# EasyEDA Pro project SoPi.epro, board PCB1
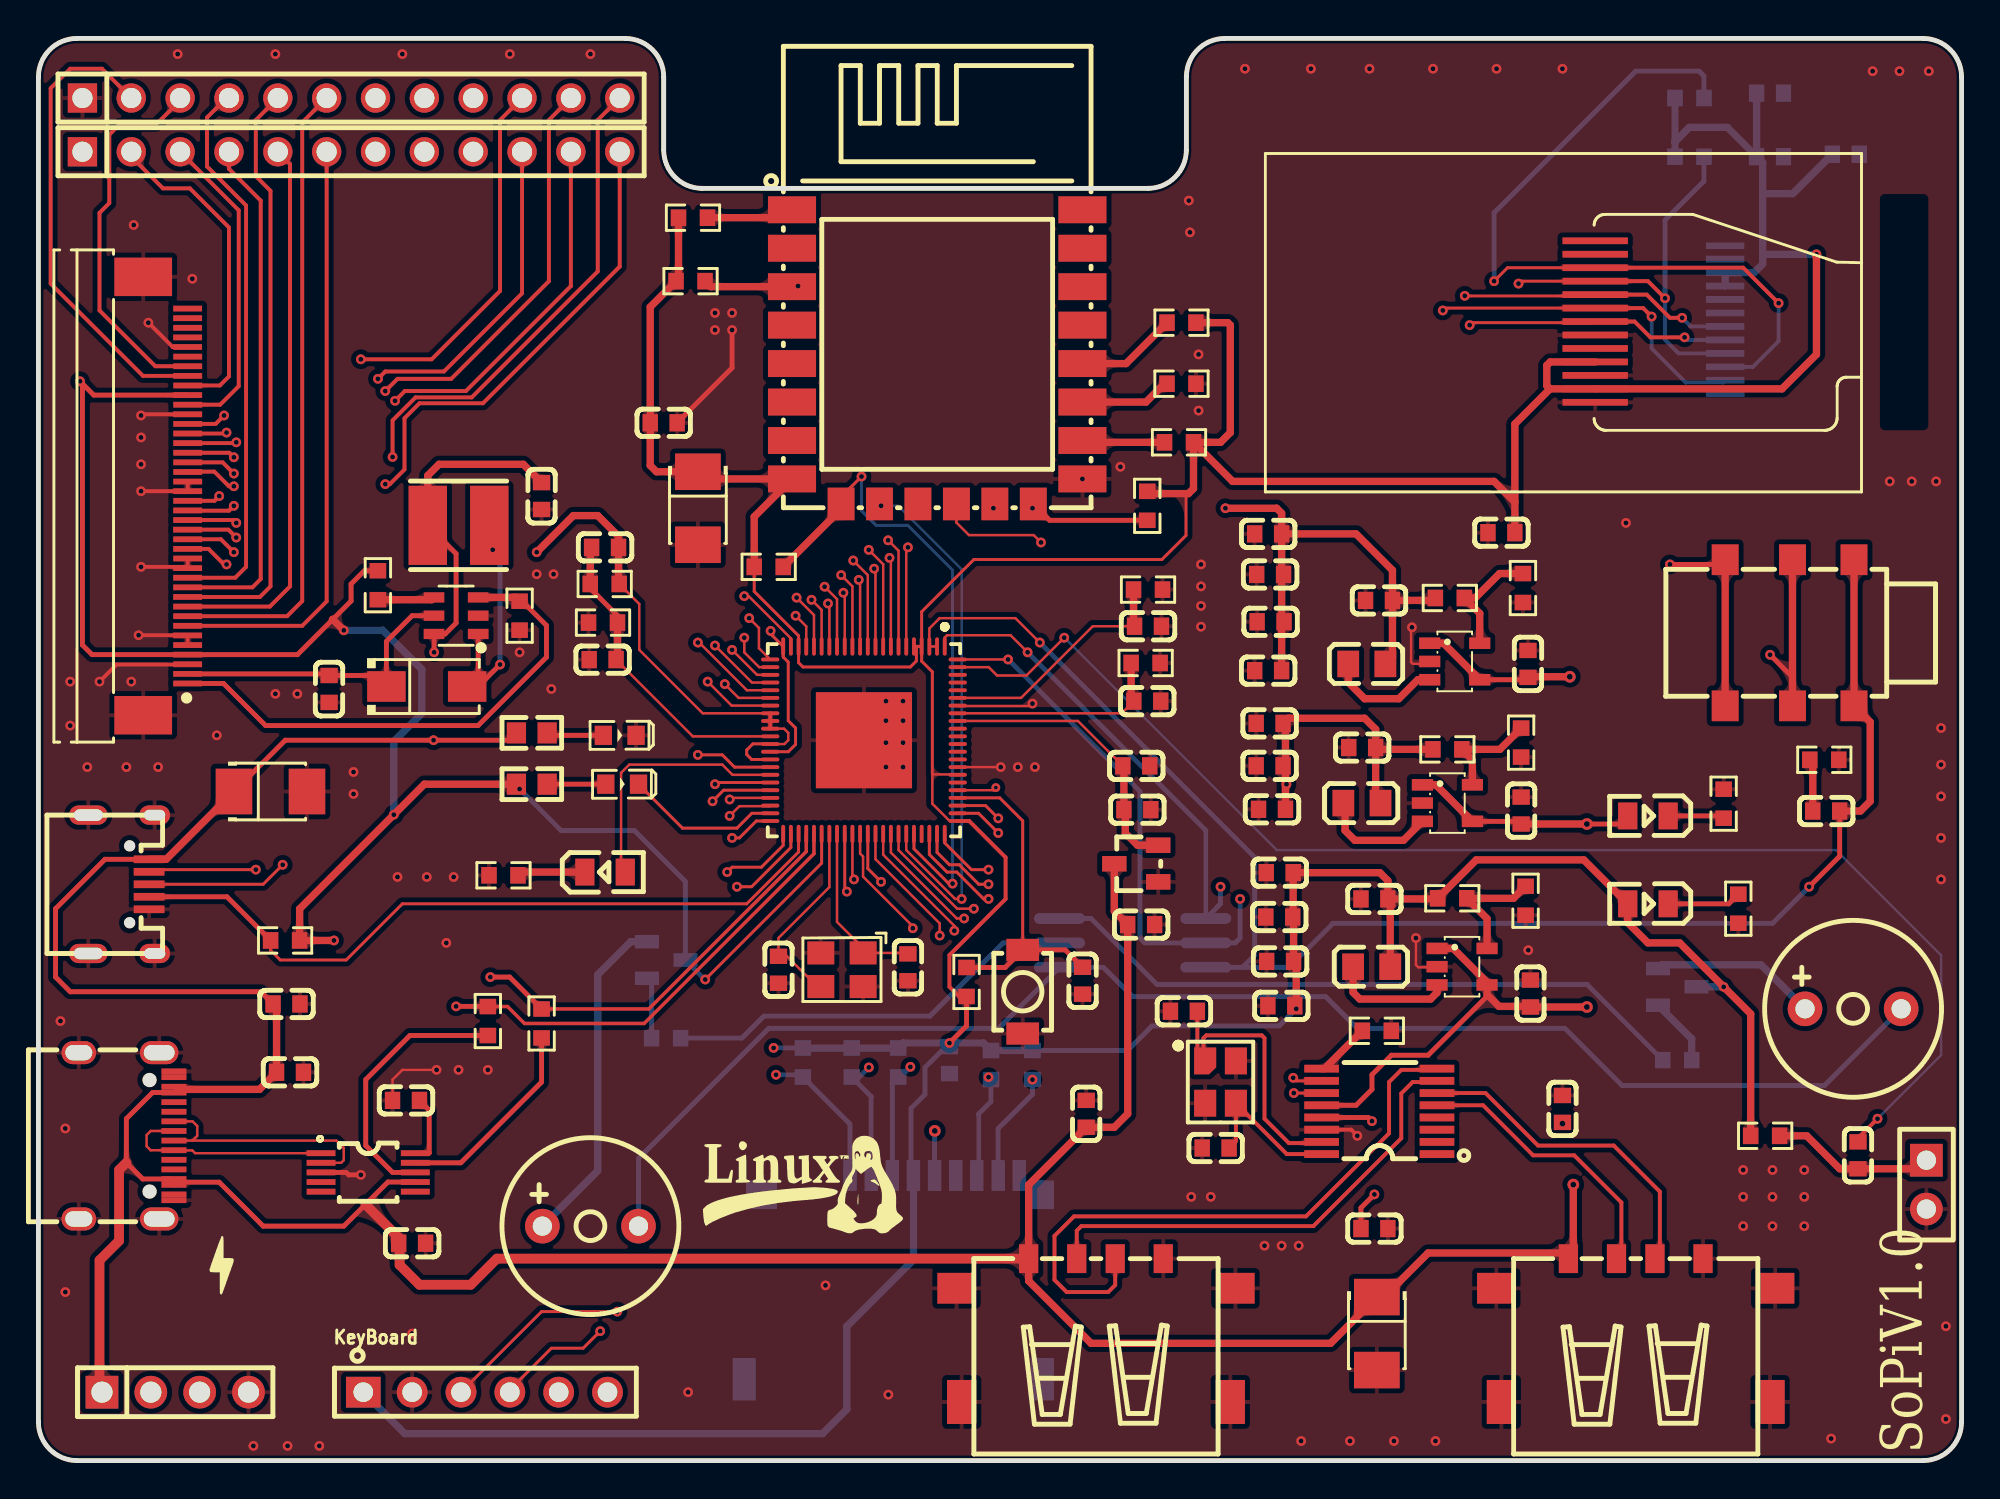
[diagram p2: board, top side]
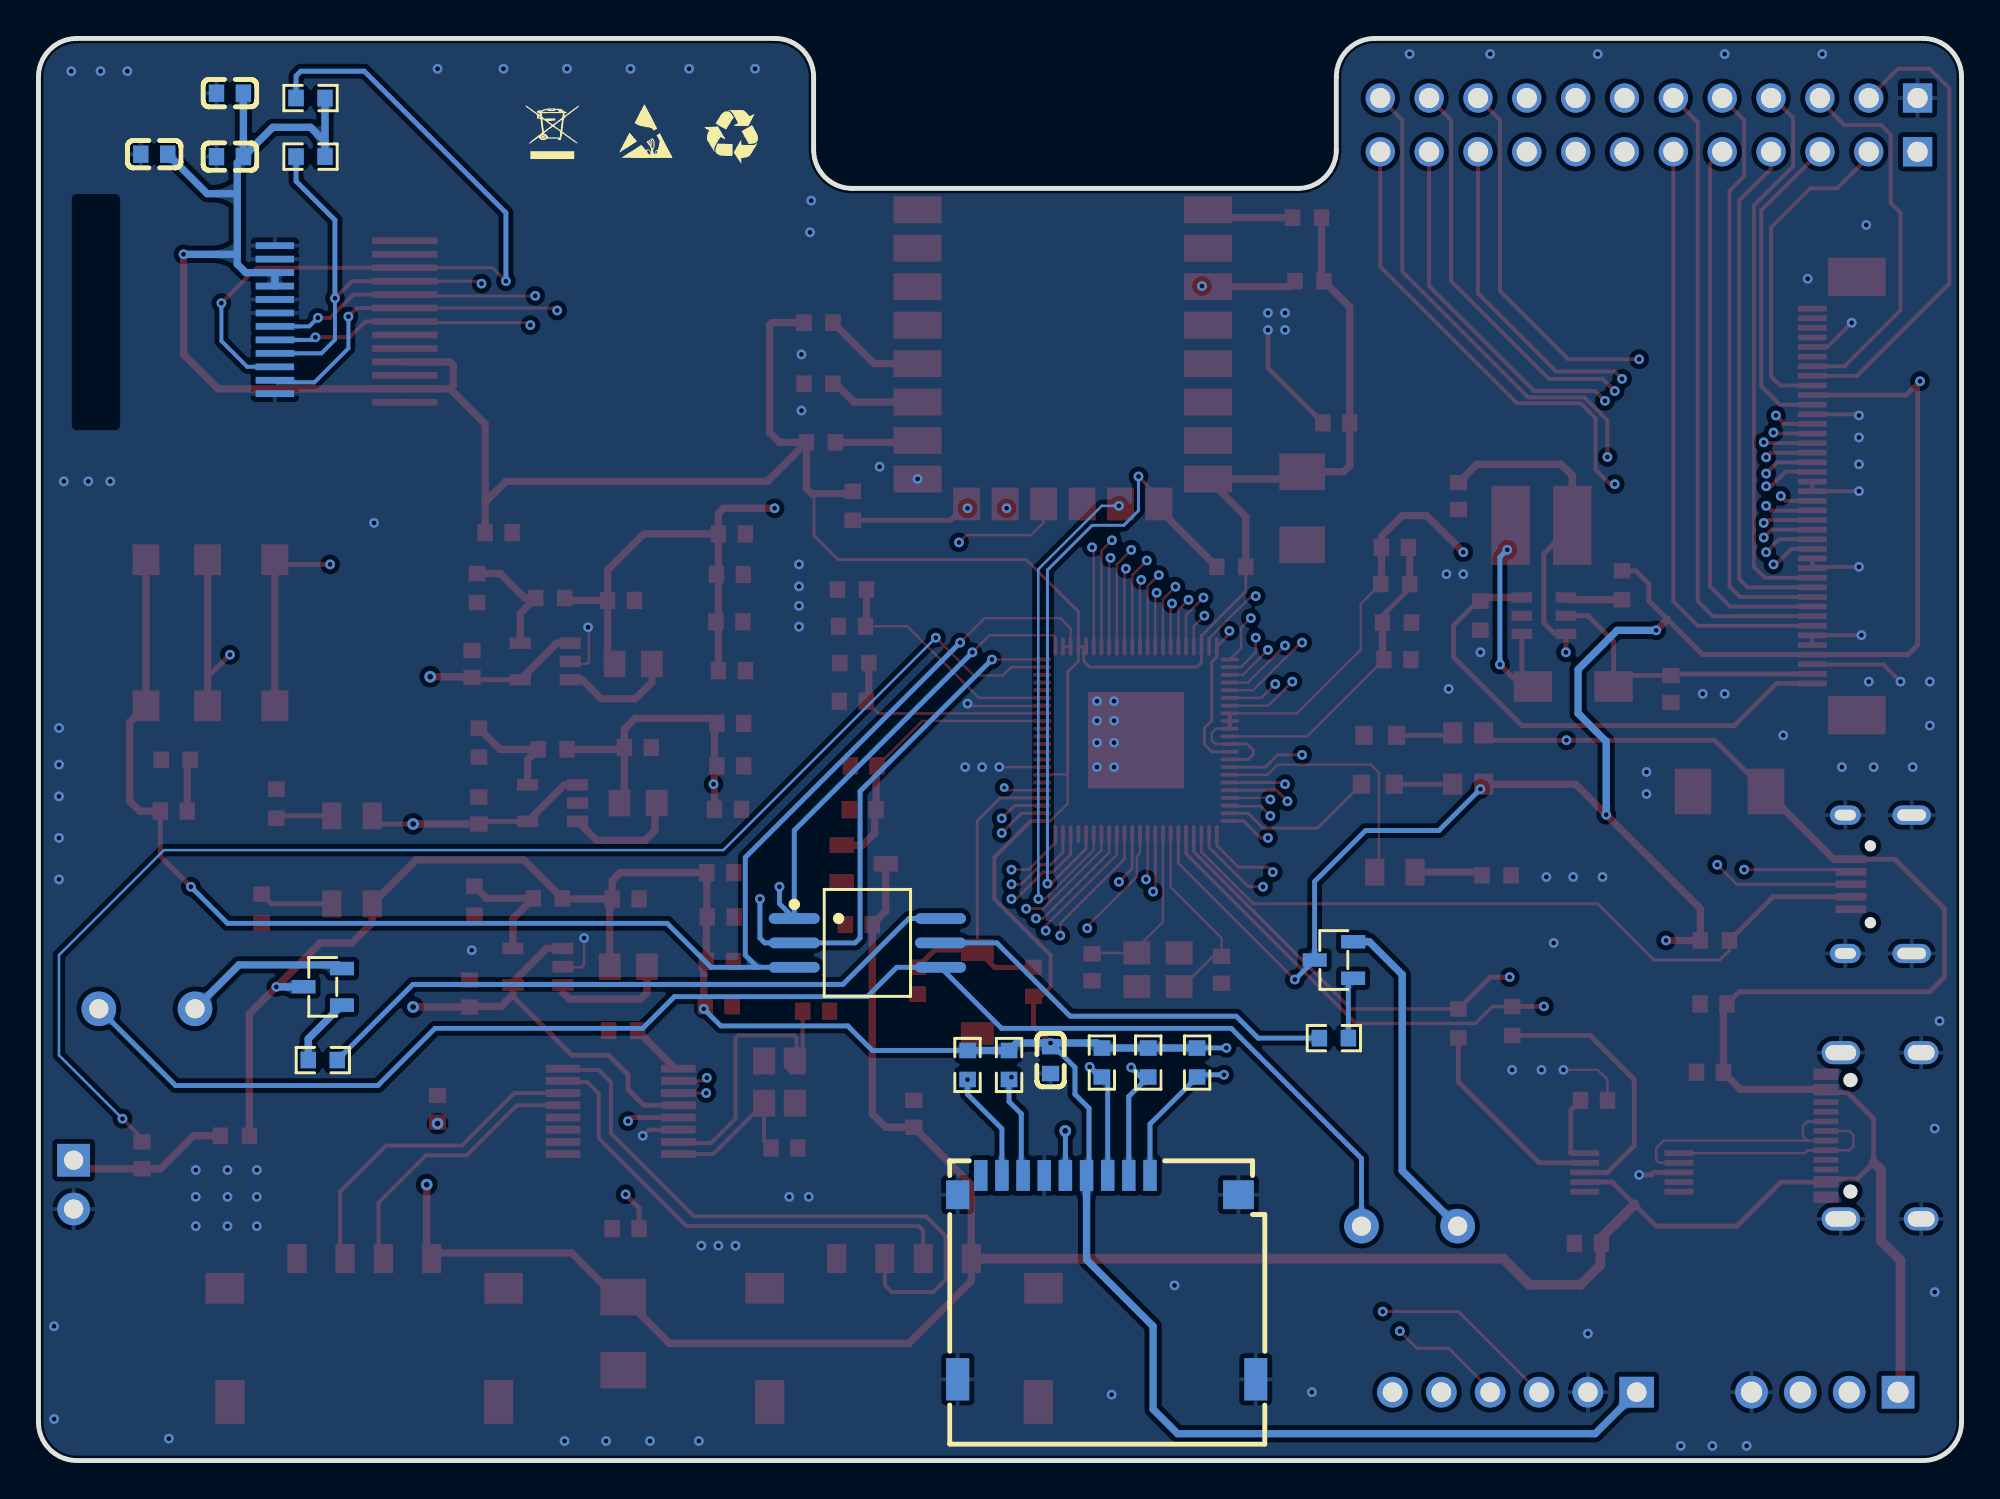
[diagram p3: board, bottom side, seen from below]

Outline 100 x 73.97 mm; copper layers: Top Layer, Inner1, Inner2, Bottom Layer. Coordinates in mm from the lower left corner of the outline.
Outline path: 0,71.97 arc(0.59,73.38) 2,73.97 30.51,73.97 arc(31.93,73.38) 32.51,71.97 32.51,68.17 arc(33.1,66.75) 34.51,66.17 57.69,66.17 arc(59.11,66.75) 59.69,68.17 59.69,71.97 arc(60.28,73.38) 61.69,73.97 98,73.97 arc(99.41,73.38) 100,71.97 100,2 arc(99.41,0.59) 98,0 2,0 arc(0.59,0.59) 0,2 0,71.97
Stack: Top Layer 0.035mm 外层铜厚1oz / Dielectric1 0.2104mm 7628 RC49% 8.6mil / Inner1 0.0152mm 内层铜厚 / Dielectric2 1.065mm 1.1mm H/HOZ Copper / Inner2 0.0152mm 内层铜厚 / Dielectric3 0.2104mm 7628 RC49% 8.6mil / Bottom Layer 0.035mm 外层铜厚1oz

## Design rules (mm)
template: 自定义配置
spacing copperThickness1oz (default): track to track 0.102, other pairs 0.152 to 0.3
spacing copperThickness2oz: track to track 0.203, other pairs 0.152 to 0.3
track width copperThickness1oz (default): min 0.102, default 0.127, max 2.54
track width copperThickness2oz: min 0.127, default 0.381, max 2.54
differential pair differentialPair (default): width min 0.127, default 0.254, max 2.54; gap min 0.152, default 0.152
via viaSize (default): diameter min 0.457, default 0.508, max 10; hole min 0.203, default 0.254, max 6.299
net +2V5 uses copperThickness2oz
net +3V0 uses copperThickness2oz
net +3V3 uses copperThickness2oz
net +1V1 uses copperThickness2oz
net +5V uses copperThickness2oz

## Placement (name value [footprint] x y rotation side)
2G1  10K  [R0603]  59.44 56.01 180 top
15V1  10K  [R0603]  59.31 52.96 180 top
BUZZER1  2.7kHz  [BUZ-TH_BD9.0-P5.00-D0.6-FD]  94.36 23.5 0 top
BUZZER2  2.7kHz  [BUZ-TH_BD9.0-P5.00-D0.6-FD]  28.7 12.19 0 top
C1  100nF  [C0603]  29.46 47.5 0 top
C2  100nF  [C0603]  29.34 41.66 0 top
C3  22pf  [C0603]  45.21 25.65 90 top
C4  10uF  [C0603]  54.29 24.96 270 top
C5  22pf  [C0603]  38.48 25.53 90 top
C6  10uF  [C0603]  57.14 33.85 180 top
C7  100nF  [C0603]  57.09 36.13 180 top
C8  100nF  [C0603]  64.52 28.27 180 top
C9  100nF  [C0603]  64.54 30.58 0 top
C10  100nF  [C0603]  64.57 25.96 0 top
C11  100nF  [C0603]  64.07 43.62 0 top
C12  100nF  [C0603]  64.63 23.65 180 top
C13  10uF  [C0603]  69.47 29.21 0 top
C14  100nF  [C0603]  63.94 41.08 0 top
C15  1uF  [C0603]  64.05 46.09 0 top
C16  10uF  [C0603]  63.94 48.2 0 top
C17  100nF  [C0603]  64.14 33.87 0 top
C18  100nF  [C0603]  64.02 36.13 0 top
C19  100nF  [C0603]  64.02 38.34 0 top
C20  10uF  [C0603]  57.7 43.39 0 top
C21  10uF  [C0603]  57.66 39.5 0 top
C22  100nF  [C0603]  13.08 20.19 0 top
C23  10uF  [C0603]  12.9 23.75 0 top
C24  1uF  [CAP-SMD_L3.5-W2.8-R-RD]  69.6 6.6 90 top
C25  4.7uF  [C0603]  57.34 27.88 180 top
C26  10uF  [C0603]  77.58 24.29 90 top
C27  10uF  [C0603]  69.71 44.74 0 top
C28  10uF  [C0603]  68.83 37.08 0 top
C29  10uF  [C0603]  77.46 41.43 90 top
C30  10uF  [C0603]  77.1 33.81 90 top
C31  10uF  [C0603]  26.16 50.16 90 top
C32  1uF  [C0603]  15.11 40.13 90 top
C33  100nF  [CAP-SMD_L3.5-W2.8-R-RD]  34.29 49.53 90 top
C34  10uF  [C0603]  32.51 53.97 0 top
C35  104  [C0603]  92.96 33.78 180 top
C44  15pF  [C0603]  59.56 23.37 0 top
C45  15pF  [C0603]  61.21 16.26 0 top
C46  10uF  [C0603]  79.25 18.29 270 top
C47  100nF  [C0603]  54.48 18.03 270 top
C48  10uF  [C0603]  69.47 12.06 0 top
C55  0.1uF  [C0603]  90.04 67.82 180 bottom
C56  0.1uF  [C0603]  90.04 71.12 180 bottom
C57  0.1uF  [C0603]  93.98 67.94 180 bottom
C58  100nF  [C0603]  19.11 18.73 180 top
C60  1uF  [CAP-SMD_L3.5-W2.8-R-RD]  12.06 34.8 180 top
C61  4.7uF  [C0603]  76.07 48.26 180 top
C62  100nF  [C0603]  19.43 11.3 180 top
C63  100nF  [C0603]  47.37 20.83 270 bottom
C64  1uF  [C0603]  94.62 15.88 270 top
CN1  CK3.5-20-1  [AUDIO-SMD_CK3.5-20-1]  91.06 43.05 180 top
D1  -  [SMA_L4.3-W2.5-LS5.0-RD]  20.19 40.26 0 top
F1C200S1  F1C200S-88  [F1C100S/F1C200S]  42.93 37.47 270 top
H1  -  [HDR-TH_12P-P2.54-V-M]  16.26 70.87 0 top
H2  -  [HDR-TH_12P-P2.54-V-M]  16.26 68.07 0 top
KeyBoard  -  [HDR-TH_6P-P2.54-V-F]  23.24 3.56 0 top
L1  2.2uH  [L0805]  69.33 25.69 0 top
L2  2.2uH  [L0805]  69.07 41.43 0 top
L3  2.2uH  [L0805]  68.82 34.2 0 top
L4  22uH  [IND-SMD_L4.5-W4.0_SM4532]  21.84 48.64 0 top
LED1  0603  [LED0603_RED]  30.35 35.18 0 top
LED96  KT-0805G  [LED0805-R-RD]  29.46 30.61 0 top
LED97  KT-0805G  [LED0805-R-RD]  83.69 33.53 180 top
LED98  KT-0805G  [LED0805-R-RD]  83.69 28.96 180 top
MIC  -  [HDR-TH_2P-P2.54-V-F]  98.17 14.35 270 top
P1  AFC07-S40ECC-00  [CONN-SMD_AFC07-S40ECC-00]  6.6 50.16 90 top
POWER1  0603  [LED0603_RED]  30.23 37.72 0 top
POWER/TTL1  TYPE-C-31-M-12  [USB-C_SMD-TYPE-C-31-M-12]  4.57 16.89 270 top
Q3  S8550  [SOT-23-3_L2.9-W1.3-P1.90-LS2.4-BR]  85.22 24.64 180 bottom
Q4  S8550  [SOT-23-3_L2.9-W1.3-P1.90-LS2.4-BR]  32.64 26.03 180 bottom
R1  10K  [R0603]  12.83 27.05 180 top
R2  2K  [R0603#2]  25.65 37.85 0 top
R3  10K  [R0603]  44.7 20.7 270 bottom
R4  2K  [R0603#2]  25.65 35.18 0 top
R5  10K  [R0603]  39.75 20.7 270 bottom
R6  10K  [R0603]  85.85 67.82 180 bottom
R7  10K  [R0603]  51.69 20.57 90 bottom
R8  10K  [R0603]  48.26 24.89 90 top
R9  2.2K  [R0603]  29.45 45.59 0 top
R10  2.2K  [R0603]  29.36 43.58 0 top
R11  200K  [R0603]  57.7 45.3 0 top
R12  200K  [R0603]  57.57 41.48 0 top
R14  470  [R0603]  26.16 22.73 90 top
R15  470K  [R0603]  73.39 44.86 180 top
R16  150K  [R0603]  73.26 36.99 180 top
R18  470  [R0603]  23.37 22.86 90 top
R19  150K  [R0603]  77.1 37.34 90 top
R20  10K  [R0603]  34.04 64.64 0 top
R21  10K  [R0603]  33.91 61.34 0 top
R22  10K  [R0603]  59.44 59.18 0 top
R23  680K  [R0603]  73.52 29.24 180 top
R24  150K  [R0603]  77.33 29.12 90 top
R25  150K  [R0603]  77.19 45.38 90 top
R26  10kΩ  [R0603]  17.65 45.53 90 top
R27  12Ω  [R0603]  25.02 43.94 90 top
R28  10K  [R0603]  37.97 46.48 0 top
R29  10K  [R0603]  57.66 49.66 270 top
R30  22R  [R0603]  92.86 36.45 0 top
R73  1kΩ  [R0603]  85.22 20.83 180 bottom
R97  330Ω  [R0603]  24.18 30.44 0 top
R98  1kΩ  [R0603]  32.64 21.97 0 bottom
R99  2.2K  [R0603]  69.6 22.35 180 top
R101  330Ω  [R0603]  87.63 34.16 270 top
R102  330Ω  [R0603]  88.39 28.7 90 top
R103  10K  [R0603]  42.29 20.7 270 bottom
R104  10K  [R0603]  49.53 20.57 270 bottom
R105  10K  [R0603]  85.85 70.87 180 bottom
R109  1kΩ  [R0603]  89.79 16.89 0 top
RESET  ST-1185S  [SW-SMD_ST-1185S]  51.18 24.38 270 top
SD1  SD  [TF-SMD_TF-115K]  44.45 9.53 180 bottom
SW162  DSHP03TS-S  [SW-SMD_DSHP03TS-S]  56.9 26.92 270 bottom
U1  XC6206-3.0V  [SOT-23]  57.09 31.05 90 top
U2  1.14IPS-TFT  [1.14IPS]  79.12 59.31 0 top
U3  ESP-12F  [WIFIM-SMD_ESP-12F-ESP8266MOD]  46.74 57.4 270 top
U4  CH340E  [MSOP-10_L3.0-W3.0-P0.50-LS5.0-BL]  17.14 14.99 270 top
U6  SY8088AAC  [SOT-23-5_L3.0-W1.7-P0.95-LS2.8-BR]  73.65 41.56 180 top
U7  SY8088AAC  [SOT-23-5_L3.0-W1.7-P0.95-LS2.8-BR]  74.03 25.69 180 top
U8  FE8.1  [SSOP-16_L4.9-W3.9-P0.64-LS6.0-BL]  69.72 18.16 90 top
U9  SY8088AAC  [SOT-23-5_L3.0-W1.7-P0.95-LS2.8-BR]  73.26 34.2 180 top
U10  RY3730  [SOT-23-6_L2.9-W1.6-P0.95-LS2.8-BL]  21.72 43.94 90 top
U56  -  [1.47ST7789]  105.79 46.61 180 bottom
USART0  PZ254V-11-04P  [HDR-TH_4P-P2.54-V-M]  7.11 3.56 0 top
USB2  -  [USB-A]  83.06 6.73 0 top
USB3  -  [USB-A]  54.99 6.73 0 top
USB6  U-F-M5DD-W-2  [MICRO-USB-SMD_MICRO-USB-A17]  4.32 29.97 180 top
X1  24MHz  [OSC-SMD_4P-L3.2-W2.5-BL]  41.78 25.53 180 top
X2  12MHz  [OSC-SMD_4P-L3.2-W2.5-BL#2]  61.47 19.69 270 top

## Footprints (pads in the part's own frame, mm; a bottom-side part is the same pattern mirrored in y, then rotated)
1.14IPS
  rect 3.4x0.35 smd: 1(1.828,4.132) 2(1.828,3.432) 3(1.828,2.732) 4(1.828,2.032) 5(1.828,1.332) 6(1.828,0.632) 7(1.828,-0.068) 8(1.828,-0.768) 9(1.828,-1.468) 10(1.828,-2.168) 11(1.828,-2.868) 12(1.828,-3.568) 13(1.828,-4.268)
1.47ST7789
  rect 2x0.35 smd: 1(18.084,16.578) 2(18.084,15.878) 3(18.084,15.178) 4(18.084,14.478) 5(18.084,13.778) 6(18.084,13.078) 7(18.084,12.378) 8(18.084,11.678) 9(18.084,10.978) 10(18.084,10.278) 11(18.084,9.578) 12(18.084,8.878)
AUDIO-SMD_CK3.5-20-1
  rect 1.4x1.6 smd: 1(-3.35,3.8) 1(-3.35,-3.8) 2(-0.15,3.8) 2(-0.15,-3.8) 3(3.35,3.8) 3(3.35,-3.8)
BUZ-TH_BD9.0-P5.00-D0.6-FD
  round 1.8 hole 1: 1(-2.5,0) 2(2.5,0)
C0603
  rect 0.8x0.9 smd: 1(-0.7,0) 2(0.7,0)
CAP-SMD_L3.5-W2.8-R-RD
  rect 1.9x2.376 smd: 1(1.899,0) 2(-1.899,0)
CONN-SMD_AFC07-S40ECC-00
  rect 0.3x1.5 smd: 1(-9.75,-1.153) 2(-9.249,-1.153) 3(-8.749,-1.153) 4(-8.249,-1.153) 5(-7.75,-1.153) 6(-7.249,-1.153) 7(-6.749,-1.153) 8(-6.249,-1.153) 9(-5.749,-1.153) 10(-5.248,-1.153) 11(-4.748,-1.153) 12(-4.248,-1.153) 13(-3.748,-1.153) 14(-3.248,-1.153) 15(-2.748,-1.155) 16(-2.248,-1.154) 17(-1.748,-1.153) 18(-1.248,-1.153) 19(-0.748,-1.153) 20(-0.248,-1.157) 21(0.252,-1.157) 22(0.751,-1.157) 23(1.252,-1.157) 24(1.752,-1.157) 25(2.252,-1.157) 26(2.752,-1.157) 27(3.252,-1.157) 28(3.752,-1.157) 29(4.252,-1.157) 30(4.751,-1.157) 31(5.251,-1.157) 32(5.751,-1.157) 33(6.25,-1.157) 34(6.751,-1.157) 35(7.25,-1.157) 36(7.75,-1.153) 37(8.251,-1.153) 38(8.75,-1.153) 39(9.25,-1.153) 40(9.75,-1.153)
  rect 2x3 smd: 41(11.4,1.157) 42(-11.4,1.157)
F1C100S/F1C200S
  oval 0.95x0.2 smd: 1(-4.875,4.2) 2(-4.875,3.8) 3(-4.875,3.4) 4(-4.875,2.999) 5(-4.875,2.599) 6(-4.875,2.2) 7(-4.875,1.8) 8(-4.875,1.399) 9(-4.875,1) 10(-4.875,0.6) 11(-4.875,0.2) 12(-4.875,-0.201) 13(-4.875,-0.601) 14(-4.875,-1) 15(-4.875,-1.401) 16(-4.875,-1.8) 17(-4.875,-2.201) 18(-4.875,-2.599) 19(-4.875,-3.001) 20(-4.875,-3.4) 21(-4.875,-3.8) 22(-4.875,-4.2) 45(4.875,-4.2) 46(4.875,-3.8) 47(4.875,-3.4) 48(4.875,-3.001) 49(4.875,-2.599) 50(4.875,-2.201) 51(4.875,-1.8) 52(4.875,-1.401) 53(4.875,-1) 54(4.875,-0.601) 55(4.875,-0.201) 56(4.875,0.2) 57(4.875,0.6) 58(4.875,1) 59(4.875,1.399) 60(4.875,1.8) 61(4.875,2.2) 62(4.875,2.599) 63(4.875,2.999) 64(4.875,3.4) 65(4.875,3.8) 66(4.875,4.2)
  oval 0.2x0.95 smd: 23(-4.2,-4.875) 24(-3.801,-4.875) 25(-3.4,-4.875) 26(-3.001,-4.875) 27(-2.599,-4.875) 28(-2.201,-4.875) 29(-1.801,-4.875) 30(-1.401,-4.875) 31(-1.001,-4.875) 32(-0.601,-4.875) 33(-0.201,-4.875) 34(0.2,-4.875) 35(0.6,-4.875) 36(1,-4.875) 37(1.399,-4.875) 38(1.8,-4.875) 39(2.2,-4.875) 40(2.599,-4.875) 41(2.999,-4.875) 42(3.4,-4.875) 43(3.8,-4.875) 44(4.2,-4.875) 67(4.2,4.875) 68(3.8,4.875) 69(3.4,4.875) 70(2.999,4.875) 71(2.599,4.875) 72(2.2,4.875) 73(1.8,4.875) 74(1.399,4.875) 75(1,4.875) 76(0.6,4.875) 77(0.2,4.875) 78(-0.201,4.875) 79(-0.601,4.875) 80(-1.001,4.875) 81(-1.401,4.875) 82(-1.801,4.875) 83(-2.201,4.875) 84(-2.599,4.875) 85(-3.001,4.875) 86(-3.4,4.875) 87(-3.801,4.875) 88(-4.2,4.875)
  rect 5x5 smd: 89(0,0)
HDR-TH_2P-P2.54-V-F
  rect 1.7x1.7 hole 1: 1(-1.27,0)
  round 1.7 hole 1: 2(1.27,0)
HDR-TH_4P-P2.54-V-M
  rect 1.7x1.7 hole 1.1: 1(-3.81,0)
  round 1.7 hole 1.1: 2(-1.27,0) 3(1.27,0) 4(3.81,0)
HDR-TH_6P-P2.54-V-F
  rect 1.8x1.6 hole 1.02: 1(-6.35,0)
  round 1.6 hole 1.02: 2(-3.81,0) 3(-1.27,0) 4(1.27,0) 5(3.81,0) 6(6.35,0)
HDR-TH_12P-P2.54-V-M
  rect 1.524x1.524 hole 1.05: 1(-13.97,0)
  round 1.524 hole 1.05: 2(-11.43,0) 3(-8.89,0) 4(-6.35,0) 5(-3.81,0) 6(-1.27,0) 7(1.27,0) 8(3.81,0) 9(6.35,0) 10(8.89,0) 11(11.43,0) 12(13.97,0)
IND-SMD_L4.5-W4.0_SM4532
  rect 2x4.12 smd: 1(1.6,0) 2(-1.6,0)
L0805
  rect 1.133x1.377 smd: 1(-0.966,0) 2(0.966,0)
LED0603_RED
  rect 0.9x1 smd: 1(-0.85,0) 2(0.85,0)
LED0805-R-RD
  rect 1x1.399 smd: 1(1.05,0) 2(-1.05,0)
MICRO-USB-SMD_MICRO-USB-A17
  rect 1.6x0.399 smd: 1(-1.435,-1.3) 2(-1.435,-0.65) 3(-1.435,0) 4(-1.435,0.65) 5(-1.435,1.3)
  oval 1.6x1.001 hole 1.1x0.551: 6(-1.724,-3.599) 7(-1.724,3.599)
  oval 1.999x1.001 hole 1.501x0.6: 8(1.724,3.599) 9(1.724,-3.599)
MSOP-10_L3.0-W3.0-P0.50-LS5.0-BL
  rect 0.305x1.5 smd: 1(-1,-2.451) 2(-0.5,-2.451) 3(0,-2.451) 4(0.5,-2.451) 5(1,-2.451) 6(1,2.451) 7(0.5,2.451) 8(0,2.451) 9(-0.5,2.451) 10(-1,2.451)
OSC-SMD_4P-L3.2-W2.5-BL
  rect 1.4x1.2 smd: 1(-1.1,-0.875) 2(1.1,-0.875) 3(1.1,0.875) 4(-1.1,0.875)
OSC-SMD_4P-L3.2-W2.5-BL#2
  custom 1.4x1.15 smd: 1(-1.1,-0.8)
  rect 1.4x1.15 smd: 2(1.1,-0.8) 3(1.1,0.8) 4(-1.1,0.8)
R0603
  rect 0.806x0.864 smd: 1(-0.753,0) 2(0.753,0)
R0603#2
  rect 1x1.1 smd: 1(-0.8,0) 2(0.8,0)
SMA_L4.3-W2.5-LS5.0-RD
  rect 2x1.593 smd: 1(-2.1,0) 2(2.1,0)
SOT-23
  rect 0.81x1.27 smd: 1(-0.953,-1.143) 2(0.953,-1.143) 3(-0.013,1.143)
SOT-23-3_L2.9-W1.3-P1.90-LS2.4-BR
  rect 1.25x0.7 smd: 1(1,-0.95) 2(1,0.95) 3(-1,0)
SOT-23-5_L3.0-W1.7-P0.95-LS2.8-BR
  rect 1.1x0.6 smd: 1(1.3,-0.95) 2(1.3,0) 3(1.3,0.95) 4(-1.3,0.95) 5(-1.3,-0.95)
SOT-23-6_L2.9-W1.6-P0.95-LS2.8-BL
  rect 0.532x1.072 smd: 1(-0.95,-1.149) 2(0,-1.149) 3(0.95,-1.149) 4(0.95,1.149) 5(0,1.149) 6(-0.95,1.149)
SSOP-16_L4.9-W3.9-P0.64-LS6.0-BL
  rect 0.406x1.804 smd: 1(-2.223,-3) 2(-1.587,-3) 3(-0.953,-3) 4(-0.318,-3) 5(0.318,-3) 6(0.953,-3) 7(1.587,-3) 8(2.223,-3) 9(2.223,3) 10(1.587,3) 11(0.953,3) 12(0.318,3) 13(-0.318,3) 14(-0.953,3) 15(-1.587,3) 16(-2.223,3)
SW-SMD_DSHP03TS-S
  oval 0.56x2.655 smd: 1(-1.27,-3.803) 2(0,-3.803) 3(1.27,-3.803) 4(1.27,3.803) 5(0,3.803) 6(-1.27,3.803)
SW-SMD_ST-1185S
  rect 1.15x1.7 smd: 1(-2.175,0) 2(2.175,0)
TF-SMD_TF-115K
  rect 0.7x1.6 smd: 1(2.25,5.3) 2(1.15,5.3) 3(0.05,5.3) 4(-1.05,5.3) 5(-2.15,5.3) 6(-3.25,5.3) 7(-4.35,5.3) 8(-5.45,5.3) 9(-6.55,5.3)
  rect 1.2x2.2 smd: 10(-7.75,-5.3) 10(7.75,-5.3)
  rect 1.2x1.5 smd: 10(-7.75,4.3)
  rect 1.6x1.5 smd: 10(6.85,4.3)
USB-A
  rect 1x1.5 smd: 1(-3.5,3.77) 2(-1,3.77) 3(1,3.77) 4(3.5,3.77)
  custom 1.524x2.286 smd: 5(-6.985,-3.683) 6(6.985,-3.683)
  rect 2x1.6 smd: 7(-7.25,2.23) 8(7.25,2.23)
USB-C_SMD-TYPE-C-31-M-12
  oval 1.2x2 hole 0.8x1.6: 0(-4.325,1.706) 0(4.325,1.706)
  oval 1.2x1.8 hole 0.8x1.4: 0(-4.325,-2.474) 0(4.325,-2.474)
  rect 0.3x1.3 smd: A1(-3.35,2.474) A4(-2.55,2.474) A5(-1.25,2.474) A6(-0.25,2.474) A7(0.25,2.474) A8(1.25,2.474) A9(2.55,2.474) A12(3.35,2.474) B1(3.05,2.474) B4(2.25,2.474) B5(1.75,2.474) B6(0.75,2.474) B7(-0.75,2.474) B8(-1.75,2.474) B9(-2.25,2.474) B12(-3.05,2.474)
WIFIM-SMD_ESP-12F-ESP8266MOD
  rect 1.4x2.5 smd: 1(-7.651,-7.551) 2(-5.651,-7.551) 3(-3.651,-7.551) 4(-1.651,-7.551) 5(0.349,-7.551) 6(2.349,-7.551) 7(4.349,-7.551) 8(6.349,-7.551) 9(6.349,7.548) 10(4.349,7.55) 11(2.349,7.551) 12(0.349,7.551) 13(-1.651,7.55) 14(-3.651,7.551) 15(-5.651,7.551) 16(-7.651,7.551)
  rect 1.7x1.4 smd: 17(7.651,-5) 18(7.649,-3.002) 19(7.649,-1.004) 20(7.649,0.998) 21(7.649,2.997) 22(7.651,4.997)

## Nets
As in the schematic.

Pads without a net: F1C200S1 72 75 76 77 78 79 84 85 86; P1 35 37 38 39 40; POWER/TTL1 A5 A8 B5 B8; SD1 9; U2 1 2 9; U3 2 4 5 6 7 13 14 15 16 19; U4 4 5 6; U8 1 2 3 4

## Via types
v1: diameter 0.508, hole 0.254, Top Layer to Bottom Layer, 240 vias
v2: diameter 0.457, hole 0.203, Top Layer to Bottom Layer, 1 via
v3: diameter 0.61, hole 0.305, Top Layer to Bottom Layer, 6 vias

## Routing (per net, layer and track width the routed paths; a pad name or vN(x,y) marks a point on that pad's centre or on a via; arc(x,y) is an arc through that point)
+1V1: length 61.6
  Top Layer w0.127: F1C200S1.71 49.65,34.87 v2(49.78,35)
  Top Layer w0.152: v1(38.07,43.15) 38.07,42.99 F1C200S1.22 38.73,41.81 38.74,41.8 38.74,41.78 38.99,41.53 38.99,38.48 39.37,38.1 39.37,37.25 38.99,36.87 F1C200S1.35
  Top Layer w0.381: C28.2 69.63,36.99 R16.2 ; C28.2 69.53,38.03 68.96,38.61 64.99,38.61 C19.2 64.84,38.22 C17.2 ; C28.2 69.53,34.69 69.79,34.43 L3.2
  Inner1 w0.152: v2(49.78,35) 48.82,34.04 40.51,34.04 39.24,35.31 39.24,41.4 38.07,42.57 v1(38.07,43.15)
  Inner1 w0.254: v2(49.78,35) 64.72,35 v1(64.9,35.18)
+2V5: length 91.2
  Top Layer w0.127: F1C200S1.34 38.79,37.27 38.99,37.47 38.99,37.85 38.77,38.07 F1C200S1.32 ; F1C200S1.30 34.54,38.87 31.24,42.16 31.24,44.55 R9.2
  Top Layer w0.152: F1C200S1.36 37.08,36.47 36.83,36.72 36.83,36.96 37.15,37.27 38.04,37.27 F1C200S1.34
  Top Layer w0.203: F1C200S1.32 F1C200S1.31 F1C200S1.30
  Top Layer w0.381: v1(25.91,47.24) 27.81,49.15 29.08,49.15 30.16,48.07 C1.2 30.16,45.63 R9.2 ; L2.2 70.41,41.8 C27.2 ; R15.2 72.51,44.74 C27.2 ; C16.2 64.64,49.27 64.39,49.53 v1(61.72,49.53) ; C16.2 C14.2 ; C16.2 68.52,48.2 70.41,46.3 C27.2
  Inner1 w0.381: v1(61.72,49.53) 53.97,49.53 50.16,53.34 32,53.34 v1(25.91,47.24)
+3V0: length 15.1
  Top Layer w0.127: C7.2 54.05,38.47 F1C200S1.80
  Top Layer w0.381: C7.2 56.44,36.08 C6.2 56.51,33.78 56.51,32.64 57.15,32 U1.2
+3V3: length 440.8
  Top Layer w0.127: F1C200S1.73 47.78,35.69 46.48,35.69 46.48,34.16 47.37,33.27 47.41,33.27 47.42,33.27 F1C200S1.67
  Top Layer w0.152: F1C200S1.4 45.93,44.15 48.64,46.86 58.42,46.86 59.67,48.12 59.67,50.16 59.8,50.29 ; F1C200S1.4 F1C200S1.5 45.65,42.21 45.65,41.59 45.34,41.28 39.75,41.28 39.53,41.5 39.53,42.9 37.22,45.2 R28.1 ; F1C200S1.4 45.93,41.58 46.48,41.02 46.48,35.69 ; F1C200S1.50 40.72,31.07 v1(34.67,25.02)
  Top Layer w0.203: R8.1 47.87,24.14 47.37,24.64 47.37,26.29 50.29,29.21 50.29,31.37 48.4,33.27 F1C200S1.67
  Top Layer w0.254: R26.2 16.94,46.28 16.26,45.59 16.26,44.7 15.3,43.75 ; 2.29,56.01 2.88,55.42 P1.31 ; 2.29,56.01 2.29,42.42 2.79,41.92 P1.4 13.47,41.92 15.28,43.73 ; 2.29,56.01 v1(2.16,56.13) ; v1(47.37,21.72) 48.26,22.61 R8.1
  Top Layer w0.381: L1.2 70.29,29.09 C13.2 ; C13.2 72.73,29.21 74.76,31.24 80.36,31.24 LED98.1 82.64,27.97 83.69,26.92 85.34,26.92 v1(87.63,24.64) 89.04,23.23 R109.1 ; C13.2 70.17,30.16 69.75,30.58 C9.2 65.24,28.29 C8.1 65.27,28.23 C10.2 65.41,25.82 v1(65.41,23.5) ; 78.6,55.74 U2.12 90.67,55.74 92.46,57.53 v1(92.46,62.74) ; 78.6,55.74 78.43,55.91 78.43,56.96 78.61,57.14 80.95,57.14 ; 78.6,55.74 76.77,53.91 76.77,49.85 ; v1(15.37,27.05) R1.1 13.58,28.69 v1(18.48,33.59) 20.07,35.18 R4.1 ; 76.77,49.85 75.69,50.93 62.09,50.93 15V1.1 ; 76.77,49.85 C61.1 ; 15V1.1 60.06,50.55 59.8,50.29 57.78,50.29 R29.1 ; 15V1.1 61.47,52.96 61.98,53.47 61.98,59.05 61.85,59.18 R22.2 ; R28.1 37.22,49.09 U3.8 34.66,51.05 C33.1 32.14,51.43 31.81,51.75 C34.1 31.81,60 33.28,61.47 R20.1 ; v1(15.88,43.18) 15.3,43.75 15.3,43.73 15.28,43.73
  Inner1 w0.254: v1(2.16,56.13) 2.16,67.94 H2.1 ; v1(34.67,25.02) v1(38.23,21.46)
  Inner1 w0.381: v1(15.37,27.05) 15.88,26.54 15.88,20.07 12.83,17.02 12.83,7.62 KeyBoard.1
  Bottom Layer w0.254: v1(65.41,23.5) 64.52,22.61 57.91,22.61 56.63,21.33 R7.2 ; v1(25.02,34.92) 27.18,32.77 30.99,32.77 33.64,30.11 Q4.3 34.66,25.02 v1(34.67,25.02) ; v1(47.37,21.72) 46.1,20.45 46.1,19.05 45.37,18.32 45.37,14.95 SD1.4 ; v1(38.23,21.46) 39.74,21.46
  Bottom Layer w0.381: 89.66,62.76 89.66,62.23 89.22,61.79 U56.3 U56.4 ; 89.66,62.76 89.66,65.89 ; 89.66,62.76 89.68,62.74 v1(92.46,62.74) ; C55.2 89.66,67.5 89.66,65.89 ; C55.2 87.82,69.34 85.85,69.34 85.1,68.59 ; C55.2 C56.2 ; 85.1,68.59 R105.2 ; 85.1,68.59 R6.2 ; 89.66,65.89 91.23,65.89 C57.2 ; SD1.4 45.5,10.45 42.04,6.98 42.04,2.67 40.77,1.4 19.05,1.4 KeyBoard.1 ; Q3.3 v1(87.63,24.64) ; v1(18.48,33.59) 18.48,37.4 19.94,38.86 19.94,41.15 17.91,43.18 v1(15.88,43.18) ; R5.1 R103.1 R3.1 44.97,21.72 v1(47.37,21.72) 49.14,21.72 R104.1 R7.2
+5V: length 276.3
  Top Layer w0.254: 74.95,40.61 77.33,40.61 C29.1 ; R2.1 24.47,37.47 v1(20.55,37.47) 12.83,37.47 C60.1 ; U9.4 76.96,33.25 C30.1 ; v3(80.52,33.11) 82.22,33.11 LED97.1 ; v1(20.57,42.04) 20.57,42.99 U10.6 21.15,42.99 21.72,43.56 21.72,47.17 L4.2 ; C23.1 11.56,24.38 1.65,24.38 0.89,25.15 0.89,28.7 3.46,31.27 USB6.1 ; U8.12 68.52,18.48 69.34,19.3 69.34,20.07 70.36,21.08 72.26,21.08 75.33,24.15 75.33,24.24 ; POWER/TTL1.B9 6.05,19.14 6.05,19.14 5.93,19.14 4.57,17.78 4.57,15.49 5.42,14.64 6.74,14.64 POWER/TTL1.A9 7.18,14.48 9.4,14.48 11.68,12.19 15.88,12.19 18.17,14.49 U4.7
  Top Layer w0.381: C23.1 12.38,23.56 C22.1 11.49,19.3 7.24,19.3 ; USB6.1 6.64,31.27 C60.1 ; v3(80.52,23.59) C26.1 77.55,23.62 75.95,23.62 75.33,24.24 U7.4 75.33,24.88 73.57,26.64 U7.1 ; L4.2 20.24,51.23 20.83,51.82 25.21,51.82 C31.2 ; v3(79.63,40.77) 77.49,40.77 C29.1 ; U6.1 73.06,42.51 74.95,40.62 74.95,40.61 ; v3(79.81,14.35) 79.81,10.75 79.56,10.5 79.26,10.8 72.26,10.8 69.97,8.5 C24.1 67.19,6.1 54.74,6.1 51.49,9.34 51.49,14.34 C47.2 55.94,17.33 56.64,18.03 C25.2 55.94,28.57 U1.3 ; 71.96,35.15 72.66,35.15 U9.4 ; C30.1 v3(80.52,33.11)
  Top Layer w0.508: 17,13.32 18.73,11.59 C62.2 18.78,11.25 18.78,10.18 19.81,9.14 22.48,9.14 23.84,10.5 51.49,10.5 ; USART0.1 3.17,3.68 3.17,10.41 4.19,11.43 4.19,15.11 4.57,15.49
  Inner1 w0.254: v1(20.57,42.04) 20.55,42.01 v1(20.55,37.47)
  Inner1 w0.381: v3(79.81,14.35) 79.81,16.96 v3(79.25,17.53) 80.26,17.53 80.52,17.78 v3(80.52,23.59) v3(80.52,33.11) 80.52,39.88 v3(79.63,40.77)
GND: length 44.2
  Top Layer w0.127: F1C200S1.74 47.8,36.07 v1(50.04,36.07) ; C58.2 18.41,19.81 18.92,20.32 v1(20.7,20.32) ; U7.2 72.69,25.65 71.75,25.65 71.63,25.78 v1(71.63,27.18) ; v1(51.69,39.37) 51.56,39.24 47.82,39.24 F1C200S1.82 ; U6.2 72.22,41.44 71.46,41.44 71.37,41.53 71.37,43.29 v1(71.42,43.34)
  Top Layer w0.203: v1(3.17,40.51) 4.06,41.4 7.74,41.4 P1.3 ; v1(5.33,46.48) 7.69,46.48 P1.13 7.76,46.92 ; v1(68.58,16.89) 68.26,17.21 U8.14 ; v1(5.72,59.18) 6.98,57.92 P1.36 ; P1.5 P1.6 7.75,42.93 v1(5.21,42.93) ; P1.29 5.39,54.42 v1(5.33,54.36) ; P1.22 7.76,50.42 7.76,50.42 v1(5.33,50.42)
  Top Layer w0.254: v1(36.07,58.8) 36.07,56.83 C34.2 ; v1(16.76,14.86) 16.13,14.86 16,14.99 U4.3
  vias: v1(1.14,22.86) v1(1.4,17.27) v1(1.4,8.76) v1(1.65,40.51) v1(1.65,38.23) v1(2.54,36.07) v1(4.57,36.07) v1(4.83,40.51) v1(4.95,64.26) v1(5.33,53.21) v1(5.33,51.82) v1(6.22,36.07) v1(7.24,73.15) v1(8,61.47) v1(9.27,37.72) v1(11.18,0.76) v1(12.32,73.15) v1(12.32,39.88) v1(12.95,0.76) v1(13.46,39.88) v1(14.61,0.76) v1(16.38,35.81) v1(16.38,34.67) v1(18.67,30.35) v1(18.92,73.15) v1(19.43,6.6) v1(20.19,30.35) v1(21.21,26.92) v1(21.59,30.35) v1(21.84,20.32) v1(23.37,20.32) v1(24.51,73.15) v1(25.02,42.04) v1(25.91,46.1) v1(26.67,40.13) v1(26.78,46.1) v1(28.7,73.15) v1(33.78,3.56) v1(35.18,59.69) v1(35.18,58.8) v1(36.07,59.69) v1(40.93,9.11) v1(44.07,39.5) v1(44.07,38.48) v1(44.07,37.34) v1(44.07,36.07) v1(44.2,3.43) v1(44.96,39.5) v1(44.96,38.48) v1(44.96,37.34) v1(44.96,36.07) v1(50.93,36.07) v1(51.82,36.07) v1(54.28,51.05) v1(56.26,51.69) v1(59.82,65.53) v1(59.88,63.88) v1(59.94,13.72) v1(60.32,57.53) v1(60.32,54.61) v1(60.45,46.61) v1(60.45,45.47) v1(60.45,44.45) v1(60.45,43.37) v1(60.96,13.72) v1(62.74,72.39) v1(63.75,11.18) v1(64.64,11.18) v1(65.53,11.18) v1(65.66,1.02) v1(66.17,72.39) v1(68.2,1.02) v1(69.22,72.39) v1(70.48,1.02) v1(72.52,72.39) v1(72.64,1.02) v1(75.82,72.39) v1(77.47,26.54) v1(79.25,72.39) v1(82.55,48.77) v1(88.65,15.11) v1(88.65,13.72) v1(88.65,12.19) v1(90.17,15.11) v1(90.17,13.72) v1(90.17,12.19) v1(91.82,15.11) v1(91.82,13.72) v1(91.82,12.19) v1(93.22,1.14) v1(95.38,72.26) v1(96.27,50.93) v1(96.77,72.26) v1(97.41,50.93) v1(98.3,72.26) v1(98.68,50.93) v1(98.93,38.1) v1(98.93,36.19) v1(98.93,34.54) v1(98.93,32.39) v1(98.93,30.23) v1(99.19,6.98) v1(99.19,2.16)
D+: length 11.3
  Top Layer w0.127: POWER/TTL1.A6 5.84,17.14 5.62,16.93 5.62,16.35 5.83,16.14 POWER/TTL1.B6 7.06,16.13 8,16.13 8.14,15.99 U4.1
D-: length 13
  Top Layer w0.127: 8,16.64 15.49,16.64 15.88,16.26 15.88,15.62 15.74,15.49 U4.2 ; 8,16.64 8.25,16.89 8.25,17.4 8.01,17.64 POWER/TTL1.B7 ; 8,16.64 POWER/TTL1.A7
DRAM_VREF_33: length 16.2
  Top Layer w0.127: C2.2 34.03,37.67 F1C200S1.33
  Top Layer w0.254: R9.1 28.69,45.36 30.11,43.94 30.11,43.58
  Top Layer w0.381: C1.1 28.69,47.43 R9.1 ; C2.2 30.11,41.73 30.11,43.58
DRX: length 49.3
  Top Layer w0.178: R18.2 24.39,23.61 25.27,22.73 31.5,22.73 40.33,31.56 F1C200S1.49
  Top Layer w0.254: v1(21.72,23.62) 23.36,23.62 R18.2
  Inner2 w0.254: v1(21.72,23.62) 8.38,10.29 USART0.3
DRX_CH: length 10.6
  Top Layer w0.254: R14.1 26.16,19.69 21.96,15.49 U4.9
DTX: length 51.5
  Top Layer w0.178: R14.2 31.74,23.49 39.92,31.67 F1C200S1.48
  Top Layer w0.254: R14.2 24.5,25.15 v1(23.49,25.15)
  Inner2 w0.254: v1(23.49,25.15) 21.46,25.15 7.49,11.18 7.49,5.84 5.84,4.19 USART0.2
DTX_CH: length 13.9
  Top Layer w0.254: R18.1 19.31,22.11 17.02,19.81 17.02,16.38 18.41,14.99 U4.8
ESP_INT: length 24
  Top Layer w0.127: U3.21 49.73,49.61 v1(49.66,49.53) ; v1(35.94,34.38) 36.02,34.47 F1C200S1.41
  Inner2 w0.127: v1(49.66,49.53) 47.12,46.99 45.72,46.99 39.62,40.89 39.62,38.07 v1(35.94,34.38)
ESP_RST: length 47.9
  Top Layer w0.127: v1(35.94,33.53) 36.45,34.04 38.02,34.04 F1C200S1.42 ; v1(39.5,61.09) 39.46,61.05 U3.3
  Top Layer w0.381: U3.3 34.95,61.05 R21.2
  Inner2 w0.127: v1(35.94,33.53) 36.45,33.53 39.85,36.93 39.85,40.49 45.72,46.36 47.62,46.36 50.29,49.02 50.29,52.32 41.53,61.09 v1(39.5,61.09)
HOSCI: length 10.3
  Top Layer w0.127: X1.3 40.5,24.65 38.92,26.23 C5.2 38.48,27.18 41.13,29.82 F1C200S1.51
HOSCO: length 9.2
  Top Layer w0.127: F1C200S1.52 41.53,28.01 43.14,26.4 ; C3.2 45.16,26.4 43.14,26.4 ; 43.14,26.4 X1.1
HPCOM: length 82
  Top Layer w0.127: v1(52.07,42.55) 50.8,43.81 46.86,43.81 46.33,43.28 F1C200S1.3 F1C200S1.2
  Top Layer w0.254: C35.1 93.66,31.43 v1(92.07,29.84)
  Top Layer w0.381: C35.1 94.74,33.78 95.25,34.29 95.25,38.41 CN1.1 CN1.1
  Bottom Layer w0.254: v1(92.07,29.84) 90.17,27.94 67.31,27.94 65.02,25.65 62.61,25.65 ; 62.61,25.65 63.25,26.29 63.25,31.37 v1(52.07,42.55) ; 62.61,25.65 SW162.3
HPL: length 65.7
  Top Layer w0.127: 47.13,42.34 47.13,42.81 47.24,42.93 50.55,42.93 v1(51.44,42.04)
  Top Layer w0.254: v1(84.84,46.61) 87.47,46.61 CN1.3
  Top Layer w0.381: CN1.3 CN1.3
  Inner1 w0.254: v1(61.47,29.84) 78.23,46.61 v1(84.84,46.61)
  Bottom Layer w0.254: v1(61.47,29.84) 61.47,28.96 SW162.1 60.7,32.77 v1(51.44,42.04)
HPR: length 69.5
  Top Layer w0.127: F1C200S1.88 v1(50.42,41.66)
  Top Layer w0.254: v1(90.04,41.91) 91.21,40.74
  Top Layer w0.381: CN1.2 CN1.2
  Inner1 w0.254: v1(62.48,29.21) 75.18,41.91 v1(90.04,41.91)
  Bottom Layer w0.254: v1(50.42,41.66) 57.28,34.81 57.28,27.18 57.53,26.92 SW162.2 62.23,26.92 62.48,27.18 v1(62.48,29.21)
HSYNC: length 61.9
  Top Layer w0.127: v1(35.69,40.39) 36.41,39.67 F1C200S1.28
  Top Layer w0.203: H2.2 4.83,67.82 6.48,66.17 7.87,66.17 9.91,64.14 9.91,56.39 9.43,55.92 P1.32
  Inner2 w0.127: v1(35.69,40.39) 15.49,60.58 12.32,60.58 H2.2
LCD_CS: length 55.8
  Top Layer w0.152: 47.13,32.59 47.13,32.12 48.51,30.73 v1(49.4,30.73) ; U2.7 80.82,59.24 80.76,59.18 74.55,59.18 v1(74.42,59.05)
  Top Layer w0.203: U2.7 83,59.24 83.82,58.42 v1(85.6,58.42)
  Inner2 w0.152: v1(49.4,30.73) 74.42,55.75 v1(74.42,59.05)
  Bottom Layer w0.203: U56.8 85.73,58.29 v1(85.6,58.42)
LCD_DC: length 69.3
  Top Layer w0.152: 80.88,60.57 74.18,60.57 v1(74.17,60.58) ; v1(36.07,32.39) 36.45,32.39 37.33,33.27 F1C200S1.44
  Top Layer w0.203: v1(85.47,59.44) 84.84,59.44 83.63,60.64 80.95,60.64
  Inner2 w0.152: v1(74.17,60.58) 59.18,60.58 50.67,52.07 50.67,48.89 40.13,38.35 40.13,36.45 v1(36.07,32.39)
  Bottom Layer w0.203: v1(85.47,59.44) 85.92,58.99 U56.7
LCD_RST: length 74.1
  Top Layer w0.152: F1C200S1.45 38.73,32 37.59,30.86 36.07,30.86 v1(35.81,30.61) ; v1(73.03,59.82) 73.15,59.94 U2.6
  Top Layer w0.203: U2.6 83.44,59.94 v1(83.88,59.5)
  Inner2 w0.152: v1(35.81,30.61) 35.94,30.61 40.64,35.31 40.64,37.85 51.05,48.26 51.05,51.44 59.44,59.82 v1(73.03,59.82)
  Bottom Layer w0.203: U56.11 87.6,56.08 85.66,56.08 83.88,57.85 v1(83.88,59.5)
LCD_SCL: length 70.3
  Top Layer w0.152: F1C200S1.64 46.33,31.53 47.24,30.61 47.75,30.61 49.15,29.21 v1(49.4,29.21) ; v1(76.96,61.21) 77.09,61.34 U2.4
  Top Layer w0.203: v1(84.58,60.45) 83.69,61.34 U2.4
  Inner2 w0.152: v1(76.96,61.21) 76.96,56.77 v1(49.4,29.21)
  Bottom Layer w0.203: U56.9 85.29,57.59 84.58,58.29 v1(84.58,60.45)
  Bottom Layer w0.254: v1(84.58,60.45) 84.58,64.52 86.61,66.54 R6.1
LCD_SDA: length 86.5
  Top Layer w0.152: U2.3 76.39,62.04 v1(75.69,61.34) ; v1(49.4,29.97) 48.9,29.97 47.88,30.99 47.37,30.99 46.73,31.63 F1C200S1.65
  Top Layer w0.203: U2.3 88.64,62.04 v1(90.49,60.2)
  Inner2 w0.152: v1(49.4,29.97) 75.69,56.26 v1(75.69,61.34)
  Bottom Layer w0.203: v1(90.49,60.2) 90.49,58.23 89.15,56.89 U56.10
  Bottom Layer w0.254: R105.1 86.61,72.02 86.36,72.26 83.06,72.26 75.69,64.9 v1(75.69,61.34)
LED: length 8.1
  Top Layer w0.152: LED1.2 33.49,32.89 36.32,32.89 37.09,33.66 F1C200S1.43
MIC_IN: length 70.5
  Top Layer w0.127: v1(53.34,42.8) 51.37,40.83 49.85,40.83 49.41,41.27 F1C200S1.87
  Top Layer w0.203: C64.1 94.62,16.76 v1(95.63,17.78)
  Bottom Layer w0.127: v1(53.34,42.8) 64.39,31.75 93.47,31.75 98.93,26.29 98.93,21.08 v1(95.63,17.78)
PC0_CLK: length 37.2
  Top Layer w0.127: U3.22 51.73,49.57 v1(51.69,49.53) ; v1(48.13,28.19) 47.75,28.19 44.33,31.62 F1C200S1.59
  Top Layer w0.254: R29.2 52.58,48.9 U3.22
  Inner2 w0.127: v1(48.13,28.19) 48.13,28.42 46.14,30.41 46.14,42.46 51.69,48.01 v1(51.69,49.53)
PC1_CS: length 32.3
  Top Layer w0.127: v1(52.13,47.75) 51.75,48.13 48.39,48.13 47.73,48.79 U3.20 ; F1C200S1.60 44.73,31.75 47.77,28.7 v1(48.64,28.7)
  Inner2 w0.127: v1(52.13,47.75) 52.13,47.31 48.9,44.07 48.9,28.96 v1(48.64,28.7)
PC2_MISO: length 27.6
  Top Layer w0.127: 43.73,49.75 43.81,49.67 v1(43.81,49.66) ; F1C200S1.61 45.13,31.75 47.67,29.21 v1(48.01,29.21)
  Bottom Layer w0.127: v1(48.01,29.21) 48.01,46.36 44.7,49.66 v1(43.81,49.66)
PC3_MOSI: length 34
  Top Layer w0.152: F1C200S1.62 45.53,31.82 47.34,30.01 v1(47.53,30.01) ; v1(42.8,51.18) 41.74,50.12 U3.17
  Top Layer w0.381: U3.17 41.74,49.49 R28.2
  Bottom Layer w0.152: v1(42.8,51.18) 42.8,49.4 43.56,48.64 45.21,48.64 47.53,46.32 v1(47.53,30.01)
PD0: length 67
  Top Layer w0.127: F1C200S1.6 45.13,47.41 v1(45.21,47.5)
  Top Layer w0.203: H2.12 30.23,62.1 23.11,54.99 19.81,54.99 19.03,54.21 19.03,51.55 18.27,50.78 v1(18.03,50.78) ; v1(10.16,50.67) 9.91,50.67 9.14,51.44 7.78,51.44 P1.23
  Inner2 w0.127: v1(45.21,47.5) 30.23,62.48 H2.12
  Inner2 w0.203: v1(18.03,50.78) 17.92,50.67 v1(10.16,50.67)
PD1: length 72
  Top Layer w0.127: F1C200S1.7 44.73,47.32 v1(44.18,47.86)
  Top Layer w0.203: v1(18.41,52.2) 18.41,54.1 19.61,55.3 22.53,55.3 29.08,61.85 29.08,69.72 H1.12 ; P1.24 9.58,51.92 v1(10.16,51.33)
  Inner2 w0.127: H1.12 29.08,69.72 29.08,62.96 v1(44.18,47.86)
  Inner2 w0.203: v1(18.41,52.2) 17.55,51.33 v1(10.16,51.33)
PD2: length 64.2
  Top Layer w0.127: v1(44.26,46.95) 44.33,46.88 F1C200S1.8
  Top Layer w0.203: P1.25 9.92,52.42 v1(10.16,52.18) ; v1(18.54,55.12) 19.05,55.63 22.22,55.63 27.69,61.09 H2.11
  Inner2 w0.127: v1(44.26,46.95) 27.69,63.52 H2.11
  Inner2 w0.203: v1(18.54,55.12) 17.91,54.48 17.91,52.96 17.13,52.18 v1(10.16,52.18)
PD3: length 69.4
  Top Layer w0.127: F1C200S1.9 43.93,46.62 v1(43.17,47.37)
  Top Layer w0.203: P1.26 10.24,52.92 v1(10.29,52.96) ; H1.11 26.54,69.72 26.54,61.34 21.46,56.26 18.67,56.26 v1(18.03,55.63)
  Inner2 w0.127: H1.11 27.43,70.87 26.54,69.98 26.54,64 v1(43.17,47.37)
  Inner2 w0.203: v1(18.03,55.63) 17.4,54.99 17.4,53.72 16.64,52.96 v1(10.29,52.96)
PD4: length 61.1
  Top Layer w0.127: F1C200S1.10 43.53,46.32 v1(43.46,46.39)
  Top Layer w0.203: v1(9.78,53.47) 9.73,53.42 P1.27 ; v1(17.65,56.26) 18.03,56.64 21.08,56.64 25.15,60.71 H2.10
  Inner2 w0.127: v1(43.46,46.39) 25.15,64.7 H2.10
  Inner2 w0.203: v1(17.65,56.26) 14.86,53.47 v1(9.78,53.47)
PD5: length 66.5
  Top Layer w0.127: v1(42.37,46.81) 43.13,46.05 F1C200S1.11
  Top Layer w0.203: P1.28 9.21,53.92 v1(9.65,54.36) ; H1.10 24,69.72 24,60.83 20.45,57.28 v1(16.76,57.28)
  Inner2 w0.127: v1(42.37,46.81) 24,65.18 24,69.22 25.15,70.36 H1.10
  Inner2 w0.203: v1(16.76,57.28) 16.51,57.28 13.59,54.36 v1(9.65,54.36)
PD6: length 66.4
  Top Layer w0.127: F1C200S1.12 42.73,45.74 v1(42.66,45.81)
  Top Layer w0.203: 7.76,47.42 8.84,47.42 9.65,46.61 v1(9.78,46.61)
  Inner1 w0.203: v1(9.78,46.61) 15.24,46.61 16.13,47.5 16.13,58.04 22.61,64.52 H2.9
  Inner2 w0.127: v1(42.66,45.81) 22.61,65.86 H2.9
PD7: length 71.7
  Top Layer w0.127: v1(41.74,46.05) 42.33,45.47 F1C200S1.13
  Top Layer w0.203: 7.76,47.92 9.49,47.92 v1(10.16,47.24)
  Inner1 w0.203: v1(10.16,47.24) 14.48,47.24 15.62,48.39 15.62,58.17 21.34,63.88 21.34,69.6 H1.9
  Inner2 w0.127: v1(41.74,46.05) 21.34,66.46 21.34,69.6 H1.9
PD8: length 64
  Top Layer w0.127: F1C200S1.14 41.93,45.07 v1(41.86,45.14)
  Top Layer w0.203: 7.76,48.42 9.88,48.42 v1(10.29,48.01)
  Inner1 w0.203: v1(10.29,48.01) 14.35,48.01 15.11,48.77 15.11,58.29 20.07,63.25 H2.8
  Inner2 w0.127: v1(41.86,45.14) 20.07,66.93 H2.8
PD9: length 69.5
  Top Layer w0.127: F1C200S1.15 41.53,44.8 v1(40.88,45.45)
  Top Layer w0.203: 7.76,48.92 10.14,48.92 v1(10.29,48.77)
  Inner1 w0.203: H1.8 18.8,69.6 18.8,62.61 14.61,58.42 14.61,49.15 14.22,48.77 v1(10.29,48.77)
  Inner2 w0.127: v1(40.88,45.45) 18.8,67.53 18.8,68.96 20.07,70.23 H1.8
PD10: length 61.6
  Top Layer w0.127: F1C200S1.16 41.13,44.51 v1(41.06,44.58)
  Top Layer w0.203: v1(10.16,49.66) 9.91,49.4 7.77,49.4 7.76,49.42
  Inner1 w0.203: H2.7 17.53,62.1 14.22,58.8 14.22,50.16 13.72,49.66 v1(10.16,49.66)
  Inner2 w0.127: v1(41.06,44.58) 17.56,68.07 H2.7
PD11: length 68.3
  Top Layer w0.127: v1(40.2,44.77) 40.72,44.24 F1C200S1.17
  Top Layer w0.203: v1(9.4,50.16) 9.15,49.92 7.76,49.92
  Inner1 w0.203: H1.7 16.26,69.6 16.26,61.85 13.33,58.93 13.33,50.42 13.08,50.16 v1(9.4,50.16)
  Inner2 w0.127: H1.7 16.26,69.6 16.26,66.8 16.51,66.55 18.42,66.55 v1(40.2,44.77)
PD12: length 68.7
  Top Layer w0.127: v1(39.42,44.88) 40.33,43.98 F1C200S1.18
  Top Layer w0.203: H2.6 14.99,44.69 13.72,43.42 P1.7
  Inner2 w0.127: H2.6 15.11,67.94 15.11,66.93 16,66.04 18.26,66.04 v1(39.42,44.88)
PD13: length 74.4
  Top Layer w0.127: v1(39.37,43.94) 39.92,43.39 F1C200S1.19
  Top Layer w0.203: P1.8 12.93,43.92 13.72,44.7 13.72,69.6 H1.6
  Inner2 w0.127: v1(39.37,43.94) 18.54,64.77 16,64.77 13.72,67.06 13.72,69.6 H1.6
PD14: length 67.2
  Top Layer w0.127: v1(36.7,44.96) 36.93,44.96 39.13,42.76 39.13,42.34
  Top Layer w0.203: P1.9 12.03,44.42 13.08,45.47 13.08,67.44 H2.5
  Inner2 w0.127: v1(36.7,44.96) 17.65,64.01 14.86,64.01 12.45,66.42 H2.5
PD15: length 73
  Top Layer w0.127: F1C200S1.23 37.47,42.25 37.47,43.31 v1(36.96,43.81)
  Top Layer w0.203: H1.5 11.3,69.72 11.3,66.8 12.06,66.04 12.06,45.47 11.52,44.92 P1.10
  Inner2 w0.127: H1.5 11.3,69.72 11.3,66.8 14.61,63.5 17.27,63.5 v1(36.96,43.81)
PD16: length 67
  Top Layer w0.127: F1C200S1.24 37.47,41.27 36.7,42.04 v1(36.7,42.8)
  Top Layer w0.203: H2.4 9.91,67.18 11.56,65.53 11.56,45.85 11.13,45.42 P1.11
  Inner2 w0.127: v1(36.7,42.8) 16.51,62.99 14.35,62.99 9.91,67.44 H2.4
PD17: length 73.3
  Top Layer w0.127: F1C200S1.25 37.37,40.86 v1(36.07,42.16)
  Top Layer w0.203: H1.4 9.78,70.87 8.76,69.85 8.76,67.31 10.8,65.28 10.8,46.48 10.23,45.92 P1.12
  Inner2 w0.127: v1(36.07,42.16) 15.88,62.36 13.84,62.36 8.64,67.56 8.64,69.22 9.91,70.48 H1.4
PD18: length 58.6
  Top Layer w0.127: F1C200S1.26 37.1,40.47 v1(35.18,42.39)
  Top Layer w0.203: H2.3 10.41,65.02 10.41,55.88 9.45,54.92 P1.30
  Inner2 w0.127: H2.3 13.84,61.59 15.97,61.59 v1(35.18,42.39)
PD19: length 66.8
  Top Layer w0.127: v1(34.29,42.55) 34.36,42.55 36.84,40.06 F1C200S1.27
  Top Layer w0.203: P1.34 6.08,56.92 3.17,59.82 3.17,64.9 3.68,65.41 3.68,68.96 4.19,69.47 6.1,69.47 7.37,70.74 H1.3
  Inner2 w0.127: v1(34.29,42.55) 15.75,61.09 12.57,61.09 6.22,67.44 6.22,69.72 H1.3
PD21: length 74.8
  Top Layer w0.127: F1C200S1.29 36.04,39.27 v1(34.8,40.51)
  Top Layer w0.203: H1.2 3.3,72.39 1.65,72.39 0.63,71.37 0.63,61.21 5.43,56.42 P1.33
  Inner2 w0.127: v1(34.8,40.51) 15.49,59.82 12.19,59.82 5.97,66.04 4.44,66.04 3.68,66.8 3.68,69.72 H1.2
PE3: length 33.4
  Top Layer w0.152: v1(36.32,29.84) 37.08,29.84 39.13,31.89 39.13,32.59
  Inner2 w0.152: v1(36.32,29.84) 36.32,20.83 34.16,18.67 34.16,8.13 KeyBoard.6
PE9: length 41.7
  Top Layer w0.152: F1C200S1.40 35.63,34.87 v1(35.05,34.29) ; KeyBoard.3 26.16,7.75 v1(30.1,7.75)
  Inner2 w0.152: v1(30.1,7.75) 30.1,11.7 30.07,11.72 30.07,29.31 v1(35.05,34.29)
PE10: length 39.9
  Top Layer w0.152: v1(35.18,35.18) 35.27,35.27 F1C200S1.39 ; KeyBoard.4 24.51,3.68 26.67,5.84 28.32,5.84 v1(29.21,6.73)
  Inner2 w0.152: v1(35.18,35.18) 29.21,29.21 v1(29.21,6.73)
PE11_IIC_CL: length 13.6
  Top Layer w0.127: F1C200S1.38 36.09,35.67 35.56,36.19 30.72,36.19 30.3,35.77 30.3,30.64 30.42,30.52 LED96.1
PE12: length 40.2
  Top Layer w0.152: v1(34.29,36.7) 35.56,36.7 36.2,36.07 F1C200S1.37
  Inner2 w0.152: KeyBoard.5 27.03,3.57 27.03,3.79 27.81,4.57 27.81,28.19 34.29,34.67 v1(34.29,36.7)
RESET: length 17.4
  Top Layer w0.152: F1C200S1.70 49.99,34.47 51.18,33.27 RESET.1
  Top Layer w0.254: C4.1 53.39,26.56 RESET.1 50.27,25.65 R8.2
RGBA: length 15.8
  Top Layer w0.254: 7.9,40.92 15.03,40.92 C32.2 17.52,40.83 D1.1 18.09,42.6 19.43,43.94 U10.5
RGBK: length 26.8
  Top Layer w0.254: R27.2 25.15,44.7 26.42,43.43 26.42,41.78 22.86,38.23 11.81,38.23 9.62,40.41 P1.1
  Top Layer w0.381: R27.2 24.82,44.89 U10.3
SDC0_CLK: length 19.3
  Top Layer w0.152: v1(43.81,30.1) 43.13,30.79 F1C200S1.56
  Inner2 w0.152: v1(43.81,30.1) 43.94,30.1 46.23,27.81 46.23,17.53 v3(46.61,17.14)
  Bottom Layer w0.254: v3(46.61,17.14) 46.6,17.14 SD1.5
SDC0_CMD: length 19.4
  Top Layer w0.127: v1(45.47,27.69) 45.47,27.78 42.88,30.37 42.88,31.42 42.73,31.57 F1C200S1.55
  Inner2 w0.127: v1(45.47,27.69) 45.47,20.6 v1(45.34,20.48)
  Bottom Layer w0.254: v1(45.34,20.48) 44.81,19.95 R3.2 44.4,19.64 SD1.3
SDC0_D0: length 20.6
  Top Layer w0.127: F1C200S1.57 43.53,31.28 46.86,27.94 v1(46.86,27.3)
  Inner2 w0.127: v1(49.4,19.94) 48.39,20.95 48.39,21.72 46.86,23.24 v1(46.86,27.3)
  Bottom Layer w0.127: v1(49.4,19.94) 49.41,19.94 R104.2
  Bottom Layer w0.254: SD1.7 48.9,14.92 48.9,18.03 49.53,18.67 R104.2
SDC0_D1: length 21.7
  Top Layer w0.127: F1C200S1.58 43.93,31.51 47.62,27.81 v1(47.62,27.56)
  Inner2 w0.127: v1(47.62,27.56) 49.53,25.65 49.53,21.97 v1(51.69,19.81)
  Bottom Layer w0.254: R7.1 v1(51.69,19.81) 51.69,19.05 49.9,17.26 SD1.8
SDC0_D2: length 24.9
  Top Layer w0.152: F1C200S1.53 41.93,29.7 v1(42.04,29.59)
  Inner2 w0.152: v1(42.04,29.59) 44.45,27.18 44.45,24.13 41.53,21.21 39.37,21.21 38.35,20.19 v1(38.35,20.07)
  Bottom Layer w0.254: SD1.1 42.2,17.5 R5.2 39.63,20.07 v1(38.35,20.07)
SDC0_D3: length 20.5
  Top Layer w0.127: F1C200S1.54 42.33,30.31 v1(42.41,30.23)
  Inner2 w0.127: v1(43.18,20.45) 43.18,22.45 44.74,24.01 44.74,28.06 42.57,30.23 v1(42.41,30.23)
  Bottom Layer w0.254: SD1.2 43.3,18.94 R103.2 42.68,19.95 v1(43.18,20.45)
USB_ID: length 38.7
  Top Layer w0.152: 39.53,32.59 39.53,31.65 36.83,28.96 18.92,28.96 16,26.03 12.57,26.03 12.07,26.53 R1.2
  Top Layer w0.254: R1.2 9.8,29.32 USB6.4
USB_N: length 72.6
  Top Layer w0.152: v1(65.25,19.91) 65.41,19.75 U8.10 ; v1(49.91,32.64) 48.88,33.66 F1C200S1.68 ; USB6.2 5.86,30.73 v1(11.3,30.73)
  Inner1 w0.152: v1(11.3,30.73) 12.19,31.62 48.9,31.62 v1(49.91,32.64) 49.53,32.64 49.15,33.02 49.15,33.53 49.53,33.91 51.24,33.91 v1(65.25,19.91)
USB_P: length 72.6
  Top Layer w0.152: F1C200S1.69 49.25,34.06 v1(49.91,33.4) ; U8.11 v1(65.28,19.11) ; USB6.3 11.68,29.97 v1(12.7,30.99)
  Inner1 w0.152: v1(65.28,19.11) 50.99,33.4 v1(49.91,33.4) 50.55,32.77 50.55,31.75 50.04,31.24 12.95,31.24 v1(12.7,30.99)
$1N3555: length 11.5
  Top Layer w0.127: F1C200S1.81 56.33,38.87 C21.1
  Top Layer w0.381: R12.1 56.82,39.64 C21.1
$1N3556: length 12.7
  Top Layer w0.127: C20.1 54.82,43.39 51.1,39.67 F1C200S1.83
  Top Layer w0.381: C20.1 56.94,43.45 56.94,45.3
$1N3572: length 6.4
  Top Layer w0.381: U7.3 72.73,24.34 72.39,24 68.71,24 68.36,24.35 L1.1
$1N3575: length 6
  Top Layer w0.381: L2.1 68.11,40.48 68.96,39.62 70.74,39.62 71.73,40.61 72.34,40.61
$1N3576: length 6.1
  Top Layer w0.381: 71.96,33.25 70.98,32.26 68.45,32.26 67.94,32.77 67.94,34.1 L3.1
$1N3577: length 6.4
  Top Layer w0.381: U7.5 75.33,28.19 R23.1 76.7,29.24 77.33,29.87
$1N3582: length 6.3
  Top Layer w0.381: U6.5 74.95,44.06 R15.1 74.71,44.86 75.98,46.13 R25.2
$1N3583: length 5.6
  Top Layer w0.381: U9.5 74.56,36.44 74.02,36.99 75.99,36.99 R19.2
$1N3737: length 3
  Top Layer w0.254: LED1.1 R4.2
$1N3738: length 3
  Top Layer w0.254: R2.2 26.58,37.72 29.38,37.72
$1N25347: length 12.6
  Top Layer w0.254: L4.1 23.62,48.46 v1(23.62,47.37) ; v1(24,41.4) 22.86,40.26 D1.2 22.87,40.83 U10.1
  Bottom Layer w0.254: v1(23.62,47.37) 24,46.99 v1(24,41.4)
$1N25348: length 3
  Top Layer w0.381: R26.1 20.45,44.77 U10.4
$1N25744: length 4.9
  Top Layer w0.381: U3.11 57.59,55.05 58.55,56.01 58.81,56.01
$1N25746: length 5.3
  Top Layer w0.381: U3.12 56.56,57.05 R22.1
$1N25747: length 4.3
  Top Layer w0.381: 15V1.2 54.38,52.96 U3.10
$1N25764: length 4.6
  Top Layer w0.381: R20.2 38.77,64.64 U3.1
$1N25889: length 2.7
  Top Layer w0.381: C35.2 92.26,36.29 92.11,36.45
$1N26206: length 77.5
  Bottom Layer w0.254: BUZZER2.2 31.2,15.71 37.97,22.48 49.92,22.48 SW162.4 55.37,25.65 56.9,24.13 66.93,24.13 68.58,22.48 79.38,22.48 82.35,19.51 92.87,19.51 BUZZER1.2
$1N26210: length 17.5
  Bottom Layer w0.381: BUZZER2.1 29.08,15.07 29.08,25.27 30.8,26.98 Q4.2
$1N26212: length 8.7
  Bottom Layer w0.381: BUZZER1.1 89.57,25.78 84.41,25.78 Q3.2
$1N26214: length 3.2
  Bottom Layer w0.254: R98.1 31.89,24.84 Q4.1
$1N26215: length 21.8
  Bottom Layer w0.254: R98.2 36.58,21.97 37.72,23.11 46.35,23.11 50.16,26.92 SW162.5
$1N26216: length 3.6
  Bottom Layer w0.381: Q3.1 85.97,21.93 R73.1
$1N26217: length 34.4
  Bottom Layer w0.254: SW162.6 54.74,28.19 58.17,24.77 80.53,24.77 R73.2
$1N26707: length 2.9
  Top Layer w0.381: R99.2 66.87,20.38 U8.9
$1N26708: length 8
  Top Layer w0.203: C45.2 62.27,16.61 X2.3 64.91,15.94 U8.16
$1N26711: length 14.9
  Top Layer w0.203: C44.2 60.26,21.19 60.58,20.87 ; 60.58,20.87 60.58,21.97 60.72,22.11 63.61,22.11 63.75,21.97 63.75,17.78 65.02,16.51 66.41,16.51 66.47,16.57 U8.15 ; 60.58,20.87 X2.1
$1N26715: length 8.6
  Top Layer w0.254: v1(69.47,13.84) 68.77,13.14 C48.1 ; U8.13 69.15,17.84 v1(69.34,17.65)
  Inner1 w0.254: v1(69.47,13.84) 69.47,17.53 v1(69.34,17.65)
$1N26719: length 14.7
  Top Layer w0.203: 82.06,10.5 82.31,10.75 82.31,13.42 79.86,15.88 77.72,15.88 75.12,18.48 U8.5
$1N26720: length 17.3
  Top Layer w0.203: U8.6 75.25,19.11 77.98,16.38 81.91,16.38 84.31,13.99 84.31,10.75 84.06,10.5
$1N26721: length 32.3
  Top Layer w0.203: U8.8 72.66,20.32 70.87,20.32 70.23,19.69 70.23,17.02 65.91,12.7 53.85,12.7 52.83,11.68 52.83,9.4 53.47,8.76 55.63,8.76 55.99,9.13 55.99,10.5
$1N26722: length 24.8
  Top Layer w0.203: U8.7 72.66,19.69 71.46,19.69 70.87,19.09 70.87,16.76 66.29,12.19 54.23,12.19 53.99,11.95 53.99,10.5
$1N27551: length 3.5
  Top Layer w0.381: R97.2 25.1,30.61 LED96.2
$1N27555: length 2.9
  Top Layer w0.254: LED97.2 87.51,33.53 R101.2
$1N27558: length 3.9
  Top Layer w0.254: LED98.2 87.89,28.96 R102.2
$1N27648: length 3.7
  Top Layer w0.254: C58.1 20.32,18.22 20.32,16 20.3,15.99 U4.10
$1N49702: length 8.5
  Top Layer w0.381: MIC.1 97.72,15.17 C64.2 93.66,15.17 91.95,16.89 R109.2

## Copper pours and planes (outline as drawn; the poured copper is in the pictures)
GND on Top Layer: -1.78,76.33 102.36,76.33 102.36,-2.79 -1.78,-2.79
GND on Bottom Layer: -1.65,74.8 101.85,74.8 101.85,-1.91 -1.65,-1.91
GND on Inner1: -2.41,76.33 102.74,76.33 102.74,-4.32 -2.41,-4.32
GND on Inner2: -1.14,74.68 102.49,74.68 102.49,-1.4 -1.14,-1.4

Small or netless copper shapes (teardrops, artwork), in the pictures only: 438 on Top Layer, 111 on Bottom Layer, 44 on Inner1, 84 on Inner2

## Text on the board
Top Silkscreen Layer: SoPiV1.0
